# EAGLE design untitled (EAGLE 9.3.0)
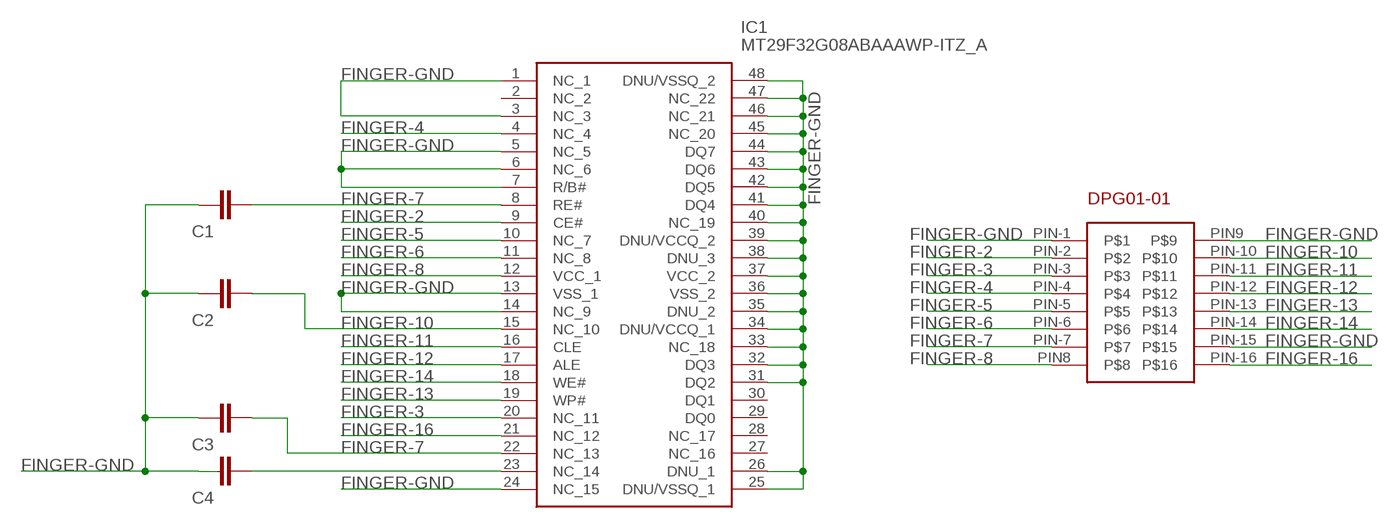
[diagram p0: schematic, sheet 1]

## Parts
C1  C-EUC0402  [C0402]
C2  C-EUC0402  [C0402]
C3  C-EUC0402  [C0402]
C4  C-EUC0402  [C0402]
IC1  MT29F32G08ABAAAWP-ITZ_A  [SOP50P2000X120-48N]
U$1  DPG01-01  [DPG01-01]

## Nets
FINGER-2: IC1.9(CE#) U$1.PIN-2
FINGER-3: IC1.20(NC_11) U$1.PIN-3
FINGER-4: IC1.4(NC_4) U$1.PIN-4
FINGER-5: IC1.10(NC_7) U$1.PIN-5
FINGER-6: IC1.11(NC_8) U$1.PIN-6
FINGER-7: C1.1 C3.1 IC1.8(RE#) IC1.22(NC_13) U$1.PIN-7
FINGER-8: IC1.12(VCC_1) U$1.PIN8
FINGER-10: C2.1 IC1.15(NC_10) U$1.PIN-10
FINGER-11: IC1.16(CLE) U$1.PIN-11
FINGER-12: IC1.17(ALE) U$1.PIN-12
FINGER-13: IC1.19(WP#) U$1.PIN-13
FINGER-14: IC1.18(WE#) U$1.PIN-14
FINGER-16: IC1.21(NC_12) U$1.PIN-16
FINGER-GND: C1.2 C2.2 C3.2 C4.2 IC1.1(NC_1) IC1.3(NC_3) IC1.5(NC_5) IC1.6(NC_6) IC1.7(R/B#) IC1.13(VSS_1) IC1.14(NC_9) IC1.24(NC_15) IC1.25(DNU/VSSQ_1) IC1.26(DNU_1) IC1.31(DQ2) IC1.32(DQ3) IC1.33(NC_18) IC1.34(DNU/VCCQ_1) IC1.35(DNU_2) IC1.36(VSS_2) IC1.37(VCC_2) IC1.38(DNU_3) IC1.39(DNU/VCCQ_2) IC1.40(NC_19) IC1.41(DQ4) IC1.42(DQ5) IC1.43(DQ6) IC1.44(DQ7) IC1.45(NC_20) IC1.46(NC_21) IC1.47(NC_22) IC1.48(DNU/VSSQ_2) U$1.PIN9 U$1.PIN-1 U$1.PIN-15
N$1: C4.1 IC1.23(NC_14)
Unconnected: IC1.2(NC_2) IC1.27(NC_16) IC1.28(NC_17) IC1.29(DQ0) IC1.30(DQ1)

## Library data of the parts
C1-C4 = rcl:C-EU: CAPACITOR, European symbol; SPICEPREFIX: C
IC1 = MT29F32G08ABAAAWP-ITZ_A:MT29F32G08ABAAAWP-ITZ_A: SLC NAND Flash 3.3V 32G-bit 4G x 8 48-Pin TSOP Source: Datasheet <https://www.micron.com/~/media/documents/products/data-sheet/nand-flash/70-series/m73a_32gb_64gb_128gb_256gb_asyncsync_nand.pdf>; DESCRIPTION: SLC NAND Flash 3.3V 32G-bit 4G x 8 48-Pin TSOP; HEIGHT: 1.2mm; MANUFACTURER_NAME: Micron; MANUFACTURER_PART_NUMBER: MT29F32G08ABAAAWP-ITZ:A; MOUSER_PART_NUMBER: 340-200226-TRAY; MOUSER_PRICE-STOCK: https://www.mouser.com/Search/Refine.aspx?Keyword=340-200226-TRAY
U$1 = Switch Cart PCB:DPG01-01

## Board
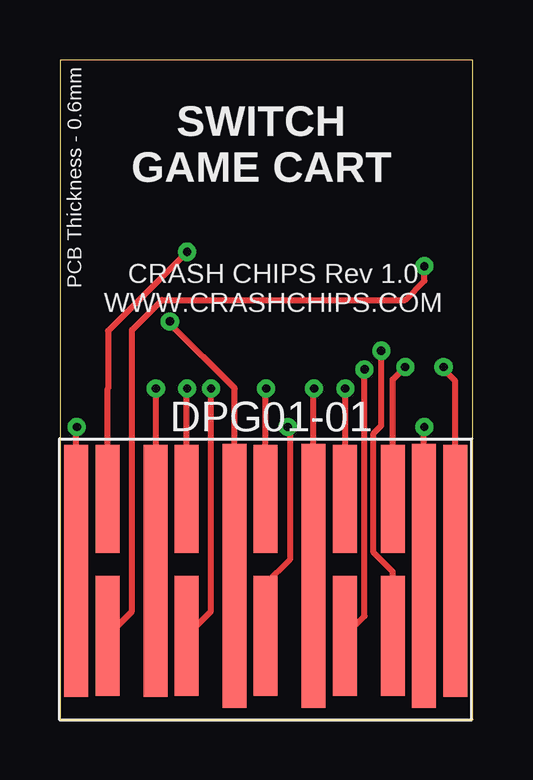
[diagram p1: board, top side]
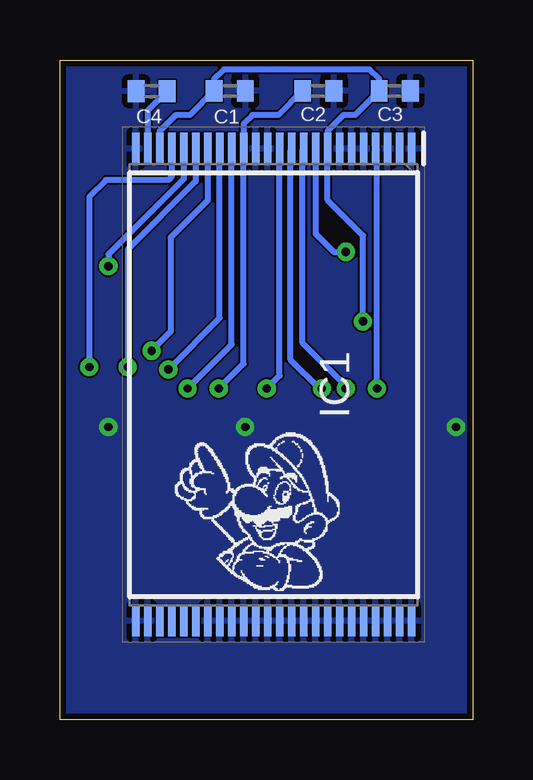
[diagram p2: board, bottom side, seen from below]

Size 17.22 x 27.5 mm. Coordinates in mm from the lower left corner, seen from the top.
Outline: 0,0 17.22,0 17.22,27.5 0,27.5 0,0
Copper layers (1*16): Top 0.035mm / dielectric 1.5mm / Bottom 0.035mm
Design rules "default *": minimum track width 6mil, minimum drill 0.35mm, track to track 3mil, track to pad 3mil, pad to pad 3mil, via to via 3mil, smd to smd 3mil, copper to edge 10mil, drill to drill 6mil, minimum pad ring 10mil, minimum via ring 8mil, stop-mask expansion 2mil, vias tented up to drill 0mil, thermal gap 10mil

### Footprints (pad centres in the part's own frame; a part is rotated, then mirrored left to right if it is on the bottom)
C0402 = smd 0.7 x 0.9: 1 -0.65,0; 2 0.65,0
SOP50P2000X120-48N = smd 1.3 x 0.3: 1 -9.85,5.75; 2 -9.85,5.25; 3 -9.85,4.75; 4 -9.85,4.25; 5 -9.85,3.75; 6 -9.85,3.25; 7 -9.85,2.75; 8 -9.85,2.25; 9 -9.85,1.75; 10 -9.85,1.25; 11 -9.85,0.75; 12 -9.85,0.25; 13 -9.85,-0.25; 14 -9.85,-0.75; 15 -9.85,-1.25; 16 -9.85,-1.75; 17 -9.85,-2.25; 18 -9.85,-2.75; 19 -9.85,-3.25; 20 -9.85,-3.75; 21 -9.85,-4.25; 22 -9.85,-4.75; 23 -9.85,-5.25; 24 -9.85,-5.75; 25 9.85,-5.75; 26 9.85,-5.25; 27 9.85,-4.75; 28 9.85,-4.25; 29 9.85,-3.75; 30 9.85,-3.25; 31 9.85,-2.75; 32 9.85,-2.25; 33 9.85,-1.75; 34 9.85,-1.25; 35 9.85,-0.75; 36 9.85,-0.25; 37 9.85,0.25; 38 9.85,0.75; 39 9.85,1.25; 40 9.85,1.75; 41 9.85,2.25; 42 9.85,2.75; 43 9.85,3.25; 44 9.85,3.75; 45 9.85,4.25; 46 9.85,4.75; 47 9.85,5.25; 48 9.85,5.75
DPG01-01 = smd 1 x 4.5: PIN8 8.3,9.2; PIN-2 1.7,9.2; PIN-5 5,9.2; PIN-11 11.6,9.2; PIN-13 13.6,9.2 | smd 1 x 5: PIN9 8.3,3.5; PIN-3 1.7,3.5; PIN-6 5,3.5; PIN-12 11.6,3.5; PIN-14 13.6,3.5 | smd 1 x 10.5: PIN-1 0.4,6.2; PIN-4 3.7,6.2; PIN-16 16.2,6.2 | smd 1 x 11: PIN-7 7,6; PIN-10 10.3,6; PIN-15 14.9,6

### Placement (x,y rotation side)
C1  10.14,26.21 0 bottom
C2  6.45,26.21 0 bottom
C3  3.26,26.21 0 bottom
C4  13.4,26.2 180 bottom
IC1  8.31,13.96 270 bottom
U$1  0.28,0 0 top

### Tracks (layer width: path | path; a pad name or v marks a point on that pad's centre or on a via)
FINGER-2  (via drill 0.35)
  Top 0.254: U$1.PIN-2 1.98,13.78 2,13.8 2,16.2 v5.3,19.5
  Bottom 0.254: IC1.9 6.56,20.26 5.8,19.5 v5.3,19.5
FINGER-3  (via drill 0.35)
  Top 0.254: U$1.PIN-3 3,4.52 3,16.24 4.26,17.5 14.4,17.5 15.2,18.3 v15.2,18.9
  Bottom 0.254: IC1.20 12.06,22.54 15.2,19.4 v15.2,18.9
FINGER-4  (via drill 0.35)
  Top 0.254: v4,13.8 3.98,13.78 U$1.PIN-4
  Bottom 0.254: v4,13.8 4,23.75 IC1.4
FINGER-5  (via drill 0.35)
  Top 0.254: U$1.PIN-5 5.28,13.78 v5.3,13.8
  Bottom 0.254: v5.3,13.8 5.3,13.9 7.1,15.7 7.1,23.77 IC1.10
FINGER-6  (via drill 0.35)
  Top 0.254: U$1.PIN-6 6.3,4.52 v6.3,13.8
  Bottom 0.254: v6.3,13.8 6.4,13.8 7.6,15 7.6,23.75 7.56,23.79 IC1.11
FINGER-7  (via drill 0.35)
  Top 0.254: U$1.PIN-7 7.28,13.78 7.3,13.8 4.58,16.52 v4.58,16.6
  Bottom 0.254: IC1.22 13.06,24.54 12.4,25.2 11.8,25.2 C1.1 10.79,26.71 10.4,27.1 4.3,27.1 3.91,26.71 C3.1 4.92,25.2 5.4,25.2 6.06,24.54 IC1.8 6.06,21.66 4.58,20.18 v4.58,16.6
FINGER-8  (via drill 0.35)
  Top 0.254: U$1.PIN8 8.58,13.78 v8.6,13.8
  Bottom 0.254: v8.6,13.8 8.06,14.34 IC1.12
FINGER-10  (via drill 0.35)
  Top 0.254: U$1.PIN-10 10.58,13.78 v10.6,13.8
  Bottom 0.254: C2.1 8.11,25.2 9.2,25.2 9.56,24.84 IC1.15 9.56,14.84 v10.6,13.8
FINGER-11  (via drill 0.35)
  Top 0.254: U$1.PIN-11 11.9,9.22 v11.9,13.8
  Bottom 0.254: v11.9,13.8 10.06,15.64 IC1.16
FINGER-12  (via drill 0.35)
  Top 0.254: U$1.PIN-12 12.7,4.32 v12.7,14.6
  Bottom 0.254: v12.7,14.6 10.56,16.74 IC1.17
FINGER-13  (via drill 0.35)
  Top 0.254: U$1.PIN-13 13.88,14.18 v14.4,14.7
  Bottom 0.254: 11.57,23.8 IC1.19 11.56,22.44 14.4,19.6 v14.4,14.7
FINGER-14  (via drill 0.35)
  Top 0.254: U$1.PIN-14 13.88,6.16 13.08,6.97 13.08,11.93 13.4,12.26 v13.4,15.38
  Bottom 0.254: IC1.18 11.06,21.64 12.6,20.1 12.6,16.18 v13.4,15.38
FINGER-16  (via drill 0.35)
  Top 0.254: U$1.PIN-16 16.48,14.12 16,14.6 v16,14.7
  Bottom 0.254: IC1.21 12.56,22.64 12.7,22.5 15.3,22.5 16,21.8 v16,14.7
FINGER-GND  (via drill 0.35)
  Top 0.254: U$1.PIN-1 0.68,12.18 v0.7,12.2 | U$1.PIN9 8.58,5.66 9.58,6.67 9.58,12.12 v9.5,12.2 | U$1.PIN-15 15.18,12.18 v15.2,12.2
  pour Bottom: -0.1,27.5 17.4,27.5 17.4,0 -0.1,0
N$1
  Bottom 0.254: C4.1 13.56,25.39 IC1.23

### Text on the board
tPlace: SWITCH / GAME CART | PCB Thickness - 0.6mm | CRASH CHIPS Rev 1.0 / WWW.CRASHCHIPS.COM